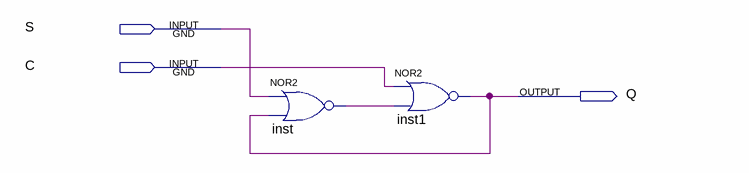
[diagram p0: schematic sheet]
// Quartus schematic srLatch.bdf as structural Verilog: 2 symbols, 3 pins
module srLatch (
  input  S,
  input  C,
  output Q
);

  wire inst_out;

  nor inst (inst_out, S, Q);
  nor inst1 (Q, C, inst_out);
endmodule
